# EAGLE design SparkFun_Tri_Axis_Accel_Breakout-LIS331 (EAGLE 7.2.0)
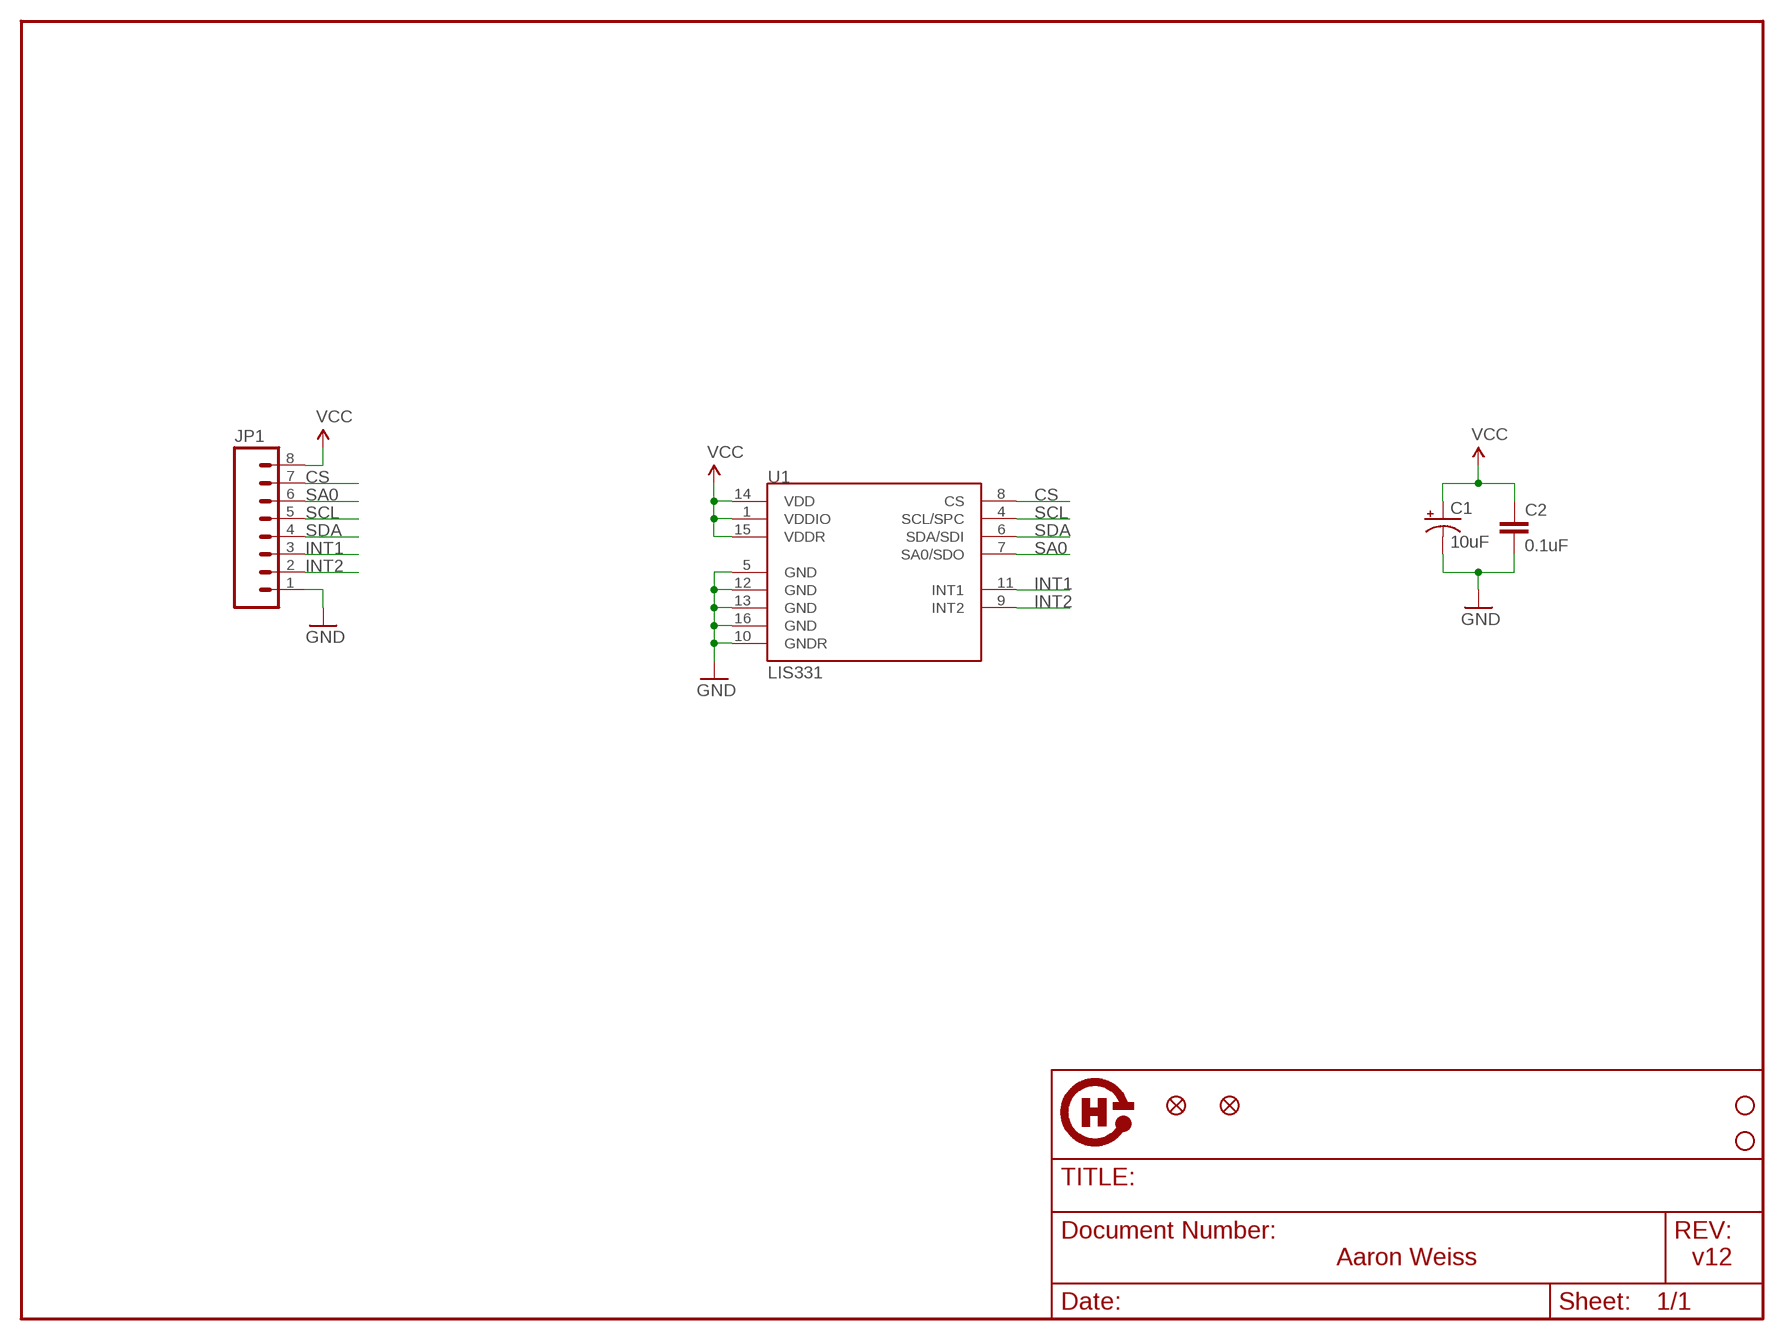
[diagram p0: schematic, sheet 1]

## Parts
C1  10uF  CAP_POL1206  [EIA3216]
C2  0.1uF  CAP0402-CAP  [0402-CAP]
JP1  M08  [1X08]
JP3  STAND-OFF  [STAND-OFF]
JP4  STAND-OFF  [STAND-OFF]
JP5  FIDUCIAL1X2  [FIDUCIAL-1X2]
JP6  FIDUCIAL1X2  [FIDUCIAL-1X2]
U1  LIS331  [LGA16-3MM]
U$1  OSHW-LOGO-SMALL  [OSHW-LOGO-SMALL]

## Nets
CS: JP1.7 U1.8(CS)
GND: C1.C(-) C2.2 JP1.1 U1.5(GND) U1.10(GNDR) U1.12(GND) U1.13(GND) U1.16(GND)
INT1: JP1.3 U1.11(INT1)
INT2: JP1.2 U1.9(INT2)
SA0: JP1.6 U1.7(SA0/SDO)
SCL: JP1.5 U1.4(SCL/SPC)
SDA: JP1.4 U1.6(SDA/SDI)
VCC: C1.A(+) C2.1 JP1.8 U1.1(VDDIO) U1.14(VDD) U1.15(VDDR)

## Notes on the sheet
- Aaron Weiss | v12

## Library data of the parts
C1 = SparkFun:CAP_POL: Capacitor Polarized These are standard SMD and PTH capacitors. Normally 10uF, 47uF, and 100uF in electrolytic and tantalum varieties. Always verify the external diameter of the through hole cap, it varies with capacity, voltage, and manufacturer. The EIA devices should be standard.
C2 = SparkFun:CAP: Capacitor Standard 0603 ceramic capacitor, and 0.1" leaded capacitor.
JP1 = SparkFun:M08: Header 8 Standard 8-pin 0.1" header. Use with straight break away headers (SKU : PRT-00116), right angle break away headers (PRT-00553), swiss pins (PRT-00743), machine pins (PRT-00117), and female headers (PRT-00115).
JP3 JP4 = SparkFun:STAND-OFF: Stand Off This is the mechanical footprint for a #4 phillips button head screw. Use the keepout ring to avoid running the screw head into surrounding components. SKU : PRT-00447
JP5 JP6 = SparkFun:FIDUCIAL: Fiducial Alignment Points Various fiducial points for machine vision alignment.
U1 = SparkFun:LIS331: LIS331HH 3-axis accelerometer
U$1 = OSHW_small:OSHW-LOGO

## Board
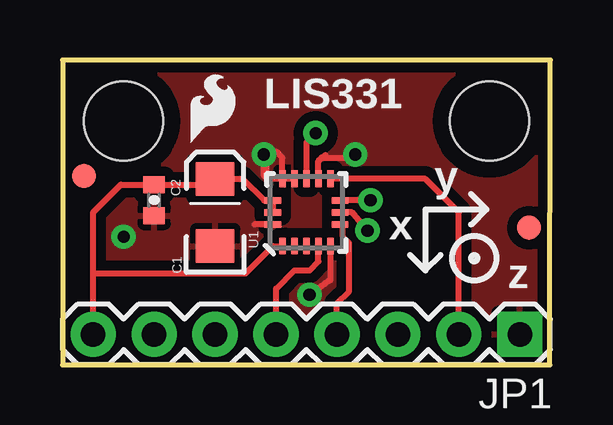
[diagram p1: board, top side]
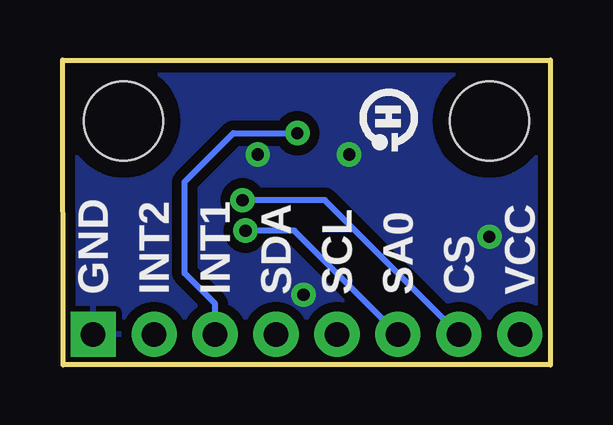
[diagram p2: board, bottom side, seen from below]

Size 20.32 x 12.7 mm. Coordinates in mm from the lower left corner, seen from the top.
Outline: 0,0 20.3,0 20.32,12.7 0,12.7 0,0
Copper layers (1*16): Top 0.035mm / dielectric 1.5mm / Bottom 0.035mm
Design rules "SparkFun": minimum track width 8mil, minimum drill 20mil, track to track 8mil, track to pad 8mil, pad to pad 8mil, via to via 8mil, smd to smd 8mil, copper to edge 8mil, drill to drill 8mil, minimum pad ring 12mil, minimum via ring 10mil, stop-mask expansion 4mil, vias tented up to drill 20mil, thermal gap 10mil

### Footprints (pad centres in the part's own frame; a part is rotated, then mirrored left to right if it is on the bottom)
EIA3216 = smd 1.4 x 1.6: A 1.4,0; C -1.4,0
0402-CAP = smd 0.7 x 0.9: 1 -0.65,0; 2 0.65,0
1X08 = drill 1.016 pad 1.88 square: 1 0,0 | drill 1.016 pad 1.88: 2 2.54,0; 3 5.08,0; 4 7.62,0; 5 10.16,0; 6 12.7,0; 7 15.24,0; 8 17.78,0
STAND-OFF = hole 3.302: 0,0
FIDUCIAL-1X2 = smd 1 x 1: 1 0,0
LGA16-3MM = smd 0.7 x 0.28: 1 -1.4,1; 2 -1.4,0.5; 3 -1.4,0; 4 -1.4,-0.5; 5 -1.4,-1; 9 1.4,-1; 10 1.4,-0.5; 11 1.4,0; 12 1.4,0.5; 13 1.4,1 | smd 0.28 x 0.7: 6 -0.5,-1.4; 7 0,-1.4; 8 0.5,-1.4; 14 0.5,1.4; 15 0,1.4; 16 -0.5,1.4

### Placement (x,y rotation side)
C1  6.35,6.35 90 top
C2  3.81,6.86 270 top
JP1  19.05,1.27 180 top
JP2  LOGO-SFESK  [SFE-LOGO-FLAME]  5.33,9.27 0 top
JP3  2.54,10.16 0 top
JP4  17.78,10.16 0 top
JP5  0.89,7.87 0 top
JP6  19.43,5.71 0 top
U1  10.16,6.35 90 top
U$1  6.73,10.29 270 bottom

### Tracks (layer width: path | path; a pad name or v marks a point on that pad's centre or on a via)
CS  (via drill 0.51)
  Top 0.254: U1.8 12.69,6.85 v12.83,6.86
  Bottom 0.254: 3.81,1.29 JP1.7 9.4,6.86 v12.83,6.86
GND  (via drill 0.51)
  Top 0.254: U1.16 8.01,5.85 8,5.84 | 8.89,8.89 9.16,8.62 U1.13 U1.12 | 10.95,8.74 10.66,8.45 U1.10 10.66,8.5 10.79,8.64 12.06,8.64 v12.19,8.76 | U1.12 8.51,7.75 8.38,7.87 v8.38,8.76 8.51,8.64 8.51,7.87 8.63,7.75 U1.12 | U1.5 11.16,3.54 v10.29,2.92
  other vias: 2.54,5.33
  pour Top (isolate 0.406): 0,12.7 0,0 20.32,0 20.32,12.7
  pour Bottom (isolate 0.406): 0,12.7 0,0 20.32,0 20.32,12.7
INT1  (via drill 0.51)
  Top 0.254: U1.11 10.16,9.27 v10.54,9.65
  Bottom 0.254: JP1.3 13.97,2.54 15.24,3.81 15.24,7.62 13.21,9.65 v10.54,9.65
INT2
  Top 0.254: U1.9 15.11,7.75 16.51,6.35 JP1.2
SA0  (via drill 0.51)
  Top 0.254: U1.7 12.06,6.35 v12.7,5.59
  Bottom 0.254: v12.7,5.59 10.67,5.59 JP1.6
SCL
  Top 0.254: U1.4 10.66,4.31 10.29,3.94 9.65,3.94 8.89,3.17 JP1.5
SDA
  Top 0.254: JP1.4 11.43,2.54 11.94,3.05 11.94,5.08 11.68,5.34 11.68,5.85 U1.6
VCC
  Top 0.254: JP1.8 1.27,3.81 | 1.27,3.81 1.27,6.35 2.43,7.51 C2.1 6.11,7.51 C1.A 7.49,7.75 8.39,6.85 U1.14 U1.15 | U1.1 8.76,4.95 7.62,3.81 1.27,3.81

### Text on the board
tPlace: LIS331 | y | x | z
bPlace: VCC | CS | SA0 | SCL | SDA | INT1 | INT2 | GND